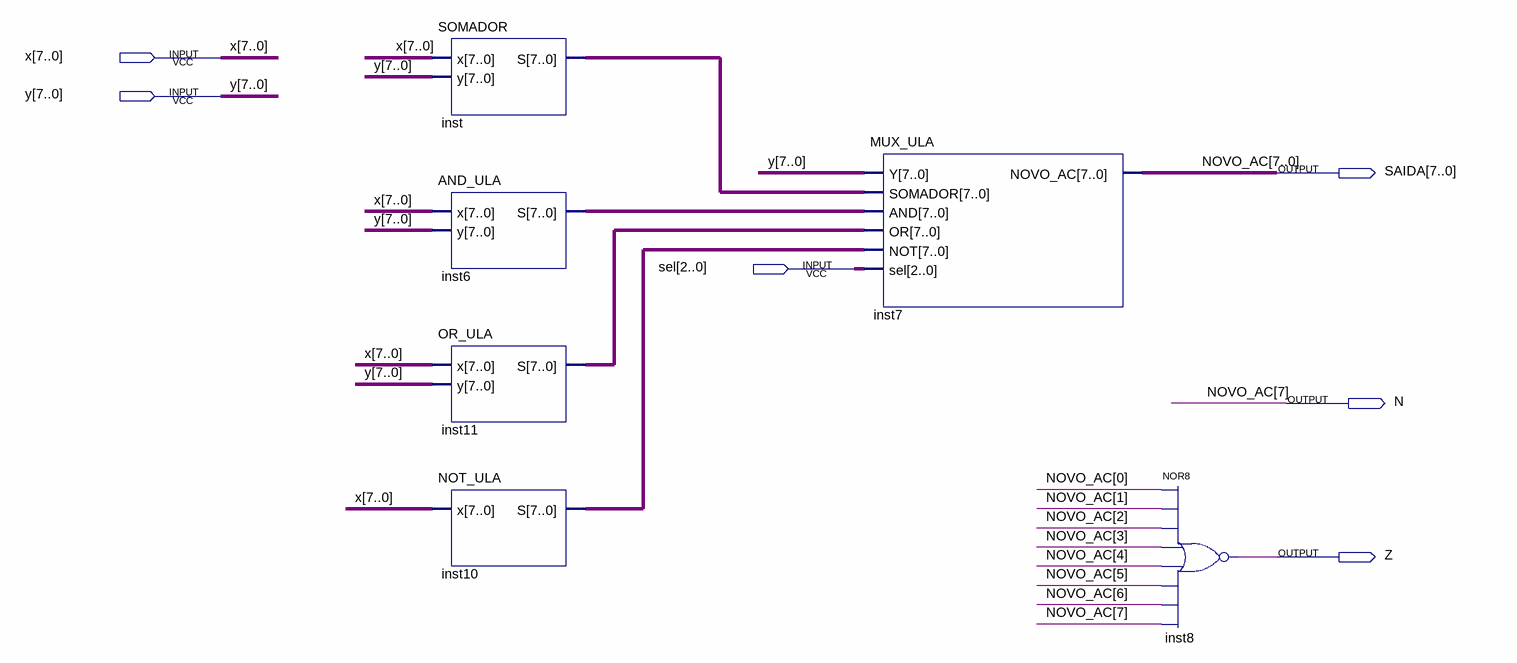
[diagram p0: schematic sheet]
// Quartus schematic ULA.bdf as structural Verilog: 6 symbols, 6 pins
module ULA (
  input  [7:0] x,
  input  [7:0] y,
  input  [2:0] sel,
  output [7:0] SAIDA,
  output N,
  output Z
);

  wire [7:0] inst6_s, inst10_s, inst11_s, inst_s;

  SOMADOR inst (.x(x), .y(y), .S(inst_s));
  AND_ULA inst6 (.x(x), .y(y), .S(inst6_s));
  OR_ULA inst11 (.x(x), .y(y), .S(inst11_s));
  NOT_ULA inst10 (.x(x), .S(inst10_s));
  MUX_ULA inst7 (
    .Y(y), .SOMADOR(inst_s), .AND(inst6_s), .OR(inst11_s), .NOT(inst10_s), .sel(sel),
    .NOVO_AC({N, SAIDA[6:0]}));
  nor inst8 (Z, SAIDA[0], SAIDA[1], SAIDA[2], SAIDA[3], SAIDA[4], SAIDA[5], SAIDA[6], N);

  assign SAIDA[7] = N;

  // Other names for the same wires on the sheet: NOVO_AC[7:0] = {N, SAIDA[6:0]}
endmodule
